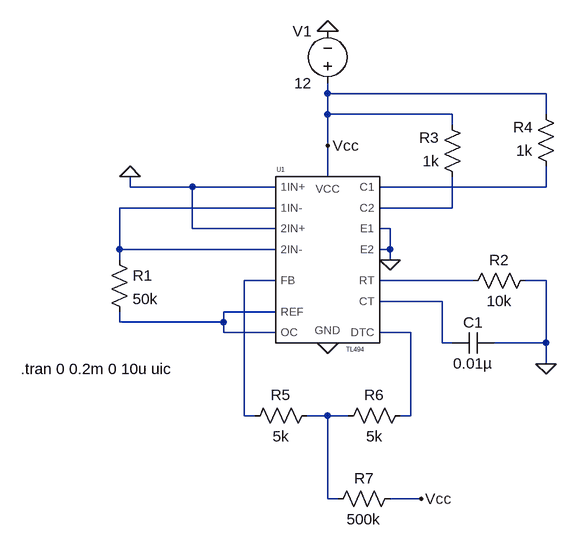
[diagram p0: schematic ytb_pwm_mod.asc]
ytb_pwm_mod.asc, the LTspice schematic file:
Version 4
SHEET 1 880 680
WIRE 224 -96 224 -112
WIRE 560 -96 224 -96
WIRE 224 -64 224 -96
WIRE 416 -64 224 -64
WIRE 560 -64 560 -96
WIRE 416 -48 416 -64
WIRE 224 -16 224 -64
WIRE 224 32 224 -16
WIRE -80 48 -80 32
WIRE 16 48 -80 48
WIRE 144 48 16 48
WIRE 560 48 560 16
WIRE 560 48 304 48
WIRE 144 80 -96 80
WIRE 416 80 416 32
WIRE 416 80 304 80
WIRE 16 112 16 48
WIRE 144 112 16 112
WIRE 320 112 304 112
WIRE -96 144 -96 80
WIRE 144 144 -96 144
WIRE 320 144 320 112
WIRE 320 144 304 144
WIRE -96 160 -96 144
WIRE 320 160 320 144
WIRE 144 192 96 192
WIRE 448 192 304 192
WIRE 560 192 528 192
WIRE 400 224 304 224
WIRE 144 240 64 240
WIRE -96 256 -96 240
WIRE 64 256 64 240
WIRE 64 256 -96 256
WIRE 64 272 64 256
WIRE 144 272 64 272
WIRE 352 272 304 272
WIRE 400 288 400 224
WIRE 416 288 400 288
WIRE 560 288 560 192
WIRE 560 288 480 288
WIRE 560 320 560 288
WIRE 96 400 96 192
WIRE 112 400 96 400
WIRE 224 400 192 400
WIRE 256 400 224 400
WIRE 352 400 352 272
WIRE 352 400 336 400
WIRE 224 528 224 400
WIRE 240 528 224 528
WIRE 368 528 320 528
FLAG 224 288 0
FLAG -80 32 0
FLAG 224 -192 0
FLAG 320 160 0
FLAG 560 320 0
FLAG 224 -16 Vcc
FLAG 368 528 Vcc
SYMBOL TL494 224 160 R0
SYMATTR InstName U1
SYMBOL res -112 144 R0
SYMATTR InstName R1
SYMATTR Value 50k
SYMBOL res 544 176 R90
WINDOW 0 0 56 VBottom 2
WINDOW 3 32 56 VTop 2
SYMATTR InstName R2
SYMATTR Value 10k
SYMBOL res 432 48 R180
WINDOW 0 36 76 Left 2
WINDOW 3 36 40 Left 2
SYMATTR InstName R3
SYMATTR Value 1k
SYMBOL res 576 32 R180
WINDOW 0 36 76 Left 2
WINDOW 3 36 40 Left 2
SYMATTR InstName R4
SYMATTR Value 1k
SYMBOL voltage 224 -96 R180
WINDOW 0 24 96 Left 2
WINDOW 3 24 16 Left 2
WINDOW 123 0 0 Left 0
WINDOW 39 0 0 Left 0
SYMATTR InstName V1
SYMATTR Value 12
SYMBOL cap 480 272 R90
WINDOW 0 0 32 VBottom 2
WINDOW 3 32 32 VTop 2
SYMATTR InstName C1
SYMATTR Value 0.01µ
SYMBOL res 208 384 R90
WINDOW 0 0 56 VBottom 2
WINDOW 3 32 56 VTop 2
SYMATTR InstName R5
SYMATTR Value 5k
SYMBOL res 352 384 R90
WINDOW 0 0 56 VBottom 2
WINDOW 3 32 56 VTop 2
SYMATTR InstName R6
SYMATTR Value 5k
SYMBOL res 336 512 R90
WINDOW 0 0 56 VBottom 2
WINDOW 3 32 56 VTop 2
SYMATTR InstName R7
SYMATTR Value 500k
TEXT -248 328 Left 2 !.tran 0 0.2m 0 10u uic

The netlist it stands for:
* ytb_pwm_mod.asc
XU1 0 N002 N004 N008 N006 N005 0 N001 0 0 N003 Vcc N007 N007 N002 0 TL494  ; pins 1IN+ 1IN- FB DTC CT RT GND C1 E1 E2 C2 VCC OC REF 2IN- 2IN+
R1 N002 N007 50k
R2 0 N005 10k
R3 N003 Vcc 1k
R4 N001 Vcc 1k
V1 Vcc 0 12
C1 0 N006 0.01µ
R5 N009 N004 5k
R6 N008 N009 5k
R7 Vcc N009 500k
.tran 0 0.2m 0 10u uic
.lib eigene/TL494.sub
.backanno
.end